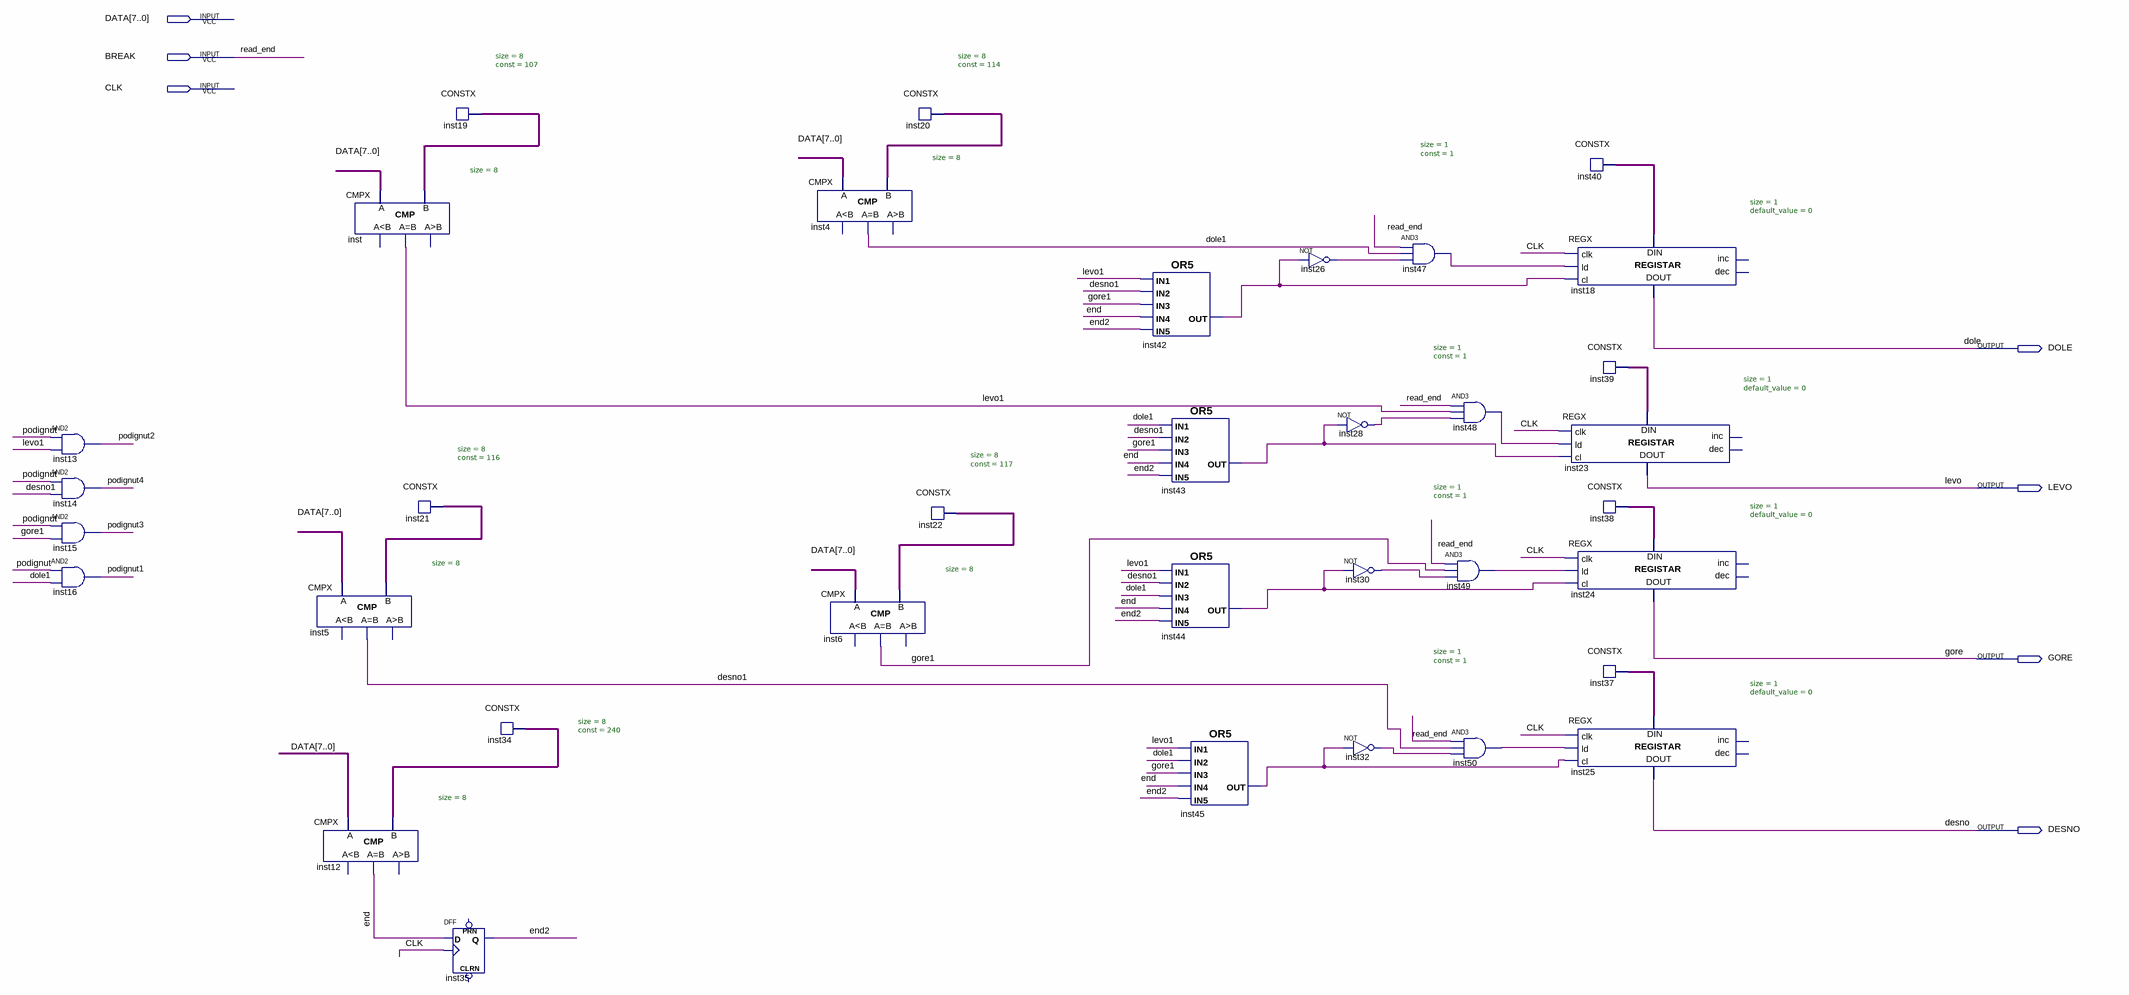
[diagram p0: schematic sheet]
// Quartus schematic Tasteri.bdf as structural Verilog: 35 symbols, 7 pins
module Tasteri (
  input  [7:0] DATA,
  input  BREAK,
  input  CLK,
  output DOLE,
  output LEVO,
  output GORE,
  output DESNO
);

  wire desno1, dole1, \end , end2, gore1, inst26_out, inst28_out, inst30_out, inst32_out, inst37_data,
       inst38_data, inst39_data, inst40_data, inst42_out, inst43_out, inst44_out, inst45_out, inst47_out,
       inst48_out, inst49_out, inst50_out, levo1, podignut, podignut1, podignut2, podignut3, podignut4;
  wire [7:0] inst19_data, inst20_data, inst21_data, inst22_data, inst34_data;

  and inst13 (podignut2, podignut, levo1);
  and inst14 (podignut4, podignut, desno1);
  and inst15 (podignut3, podignut, gore1);
  and inst16 (podignut1, podignut, dole1);
  CMPX #(.size(8)) inst5 (.A(DATA), .B(inst21_data), .eq(desno1));  // open: ls, gr
  CMPX #(.size(8)) inst12 (.A(DATA), .B(inst34_data), .eq(\end ));  // open: ls, gr
  CMPX #(.size(8)) inst (.A(DATA), .B(inst19_data), .eq(levo1));  // open: ls, gr
  CONSTX #(.size(8), .\const (116)) inst21 (.data(inst21_data));
  CONSTX #(.size(8), .\const (107)) inst19 (.data(inst19_data));
  DFF inst35 (.CLK(CLK), .D(\end ), .Q(end2));  // open: CLRN, PRN
  CONSTX #(.size(8), .\const (240)) inst34 (.data(inst34_data));
  CMPX #(.size(8)) inst4 (.A(DATA), .B(inst20_data), .eq(dole1));  // open: ls, gr
  CMPX #(.size(8)) inst6 (.A(DATA), .B(inst22_data), .eq(gore1));  // open: ls, gr
  CONSTX #(.size(8), .\const (114)) inst20 (.data(inst20_data));
  CONSTX #(.size(8), .\const (117)) inst22 (.data(inst22_data));
  or inst42 (inst42_out, levo1, desno1, gore1, \end , end2);
  or inst43 (inst43_out, dole1, desno1, gore1, \end , end2);
  or inst44 (inst44_out, levo1, desno1, dole1, \end , end2);
  or inst45 (inst45_out, levo1, dole1, gore1, \end , end2);
  not inst26 (inst26_out, inst42_out);
  not inst28 (inst28_out, inst43_out);
  not inst30 (inst30_out, inst44_out);
  not inst32 (inst32_out, inst45_out);
  and inst47 (inst47_out, BREAK, dole1, inst26_out);
  and inst48 (inst48_out, BREAK, levo1, inst28_out);
  and inst49 (inst49_out, BREAK, gore1, inst30_out);
  and inst50 (inst50_out, BREAK, desno1, inst32_out);
  CONSTX #(.size(1), .\const (1)) inst40 (.data(inst40_data));
  REGX #(.size(1), .default_value(0)) inst18 (
    .clk(CLK), .ld(inst47_out), .cl(inst42_out), .data_in(inst40_data), .data_out(DOLE));  // open: inc, dec
  REGX #(.size(1), .default_value(0)) inst23 (
    .clk(CLK), .ld(inst48_out), .cl(inst43_out), .data_in(inst39_data), .data_out(LEVO));  // open: inc, dec
  REGX #(.size(1), .default_value(0)) inst24 (
    .clk(CLK), .ld(inst49_out), .cl(inst44_out), .data_in(inst38_data), .data_out(GORE));  // open: inc, dec
  REGX #(.size(1), .default_value(0)) inst25 (
    .clk(CLK), .ld(inst50_out), .cl(inst45_out), .data_in(inst37_data), .data_out(DESNO));  // open: inc, dec
  CONSTX #(.size(1), .\const (1)) inst39 (.data(inst39_data));
  CONSTX #(.size(1), .\const (1)) inst38 (.data(inst38_data));
  CONSTX #(.size(1), .\const (1)) inst37 (.data(inst37_data));

  // Other names for the same wires on the sheet: read_end = BREAK
endmodule
